# EAGLE schematic out_matrix (EAGLE 9.6.2)
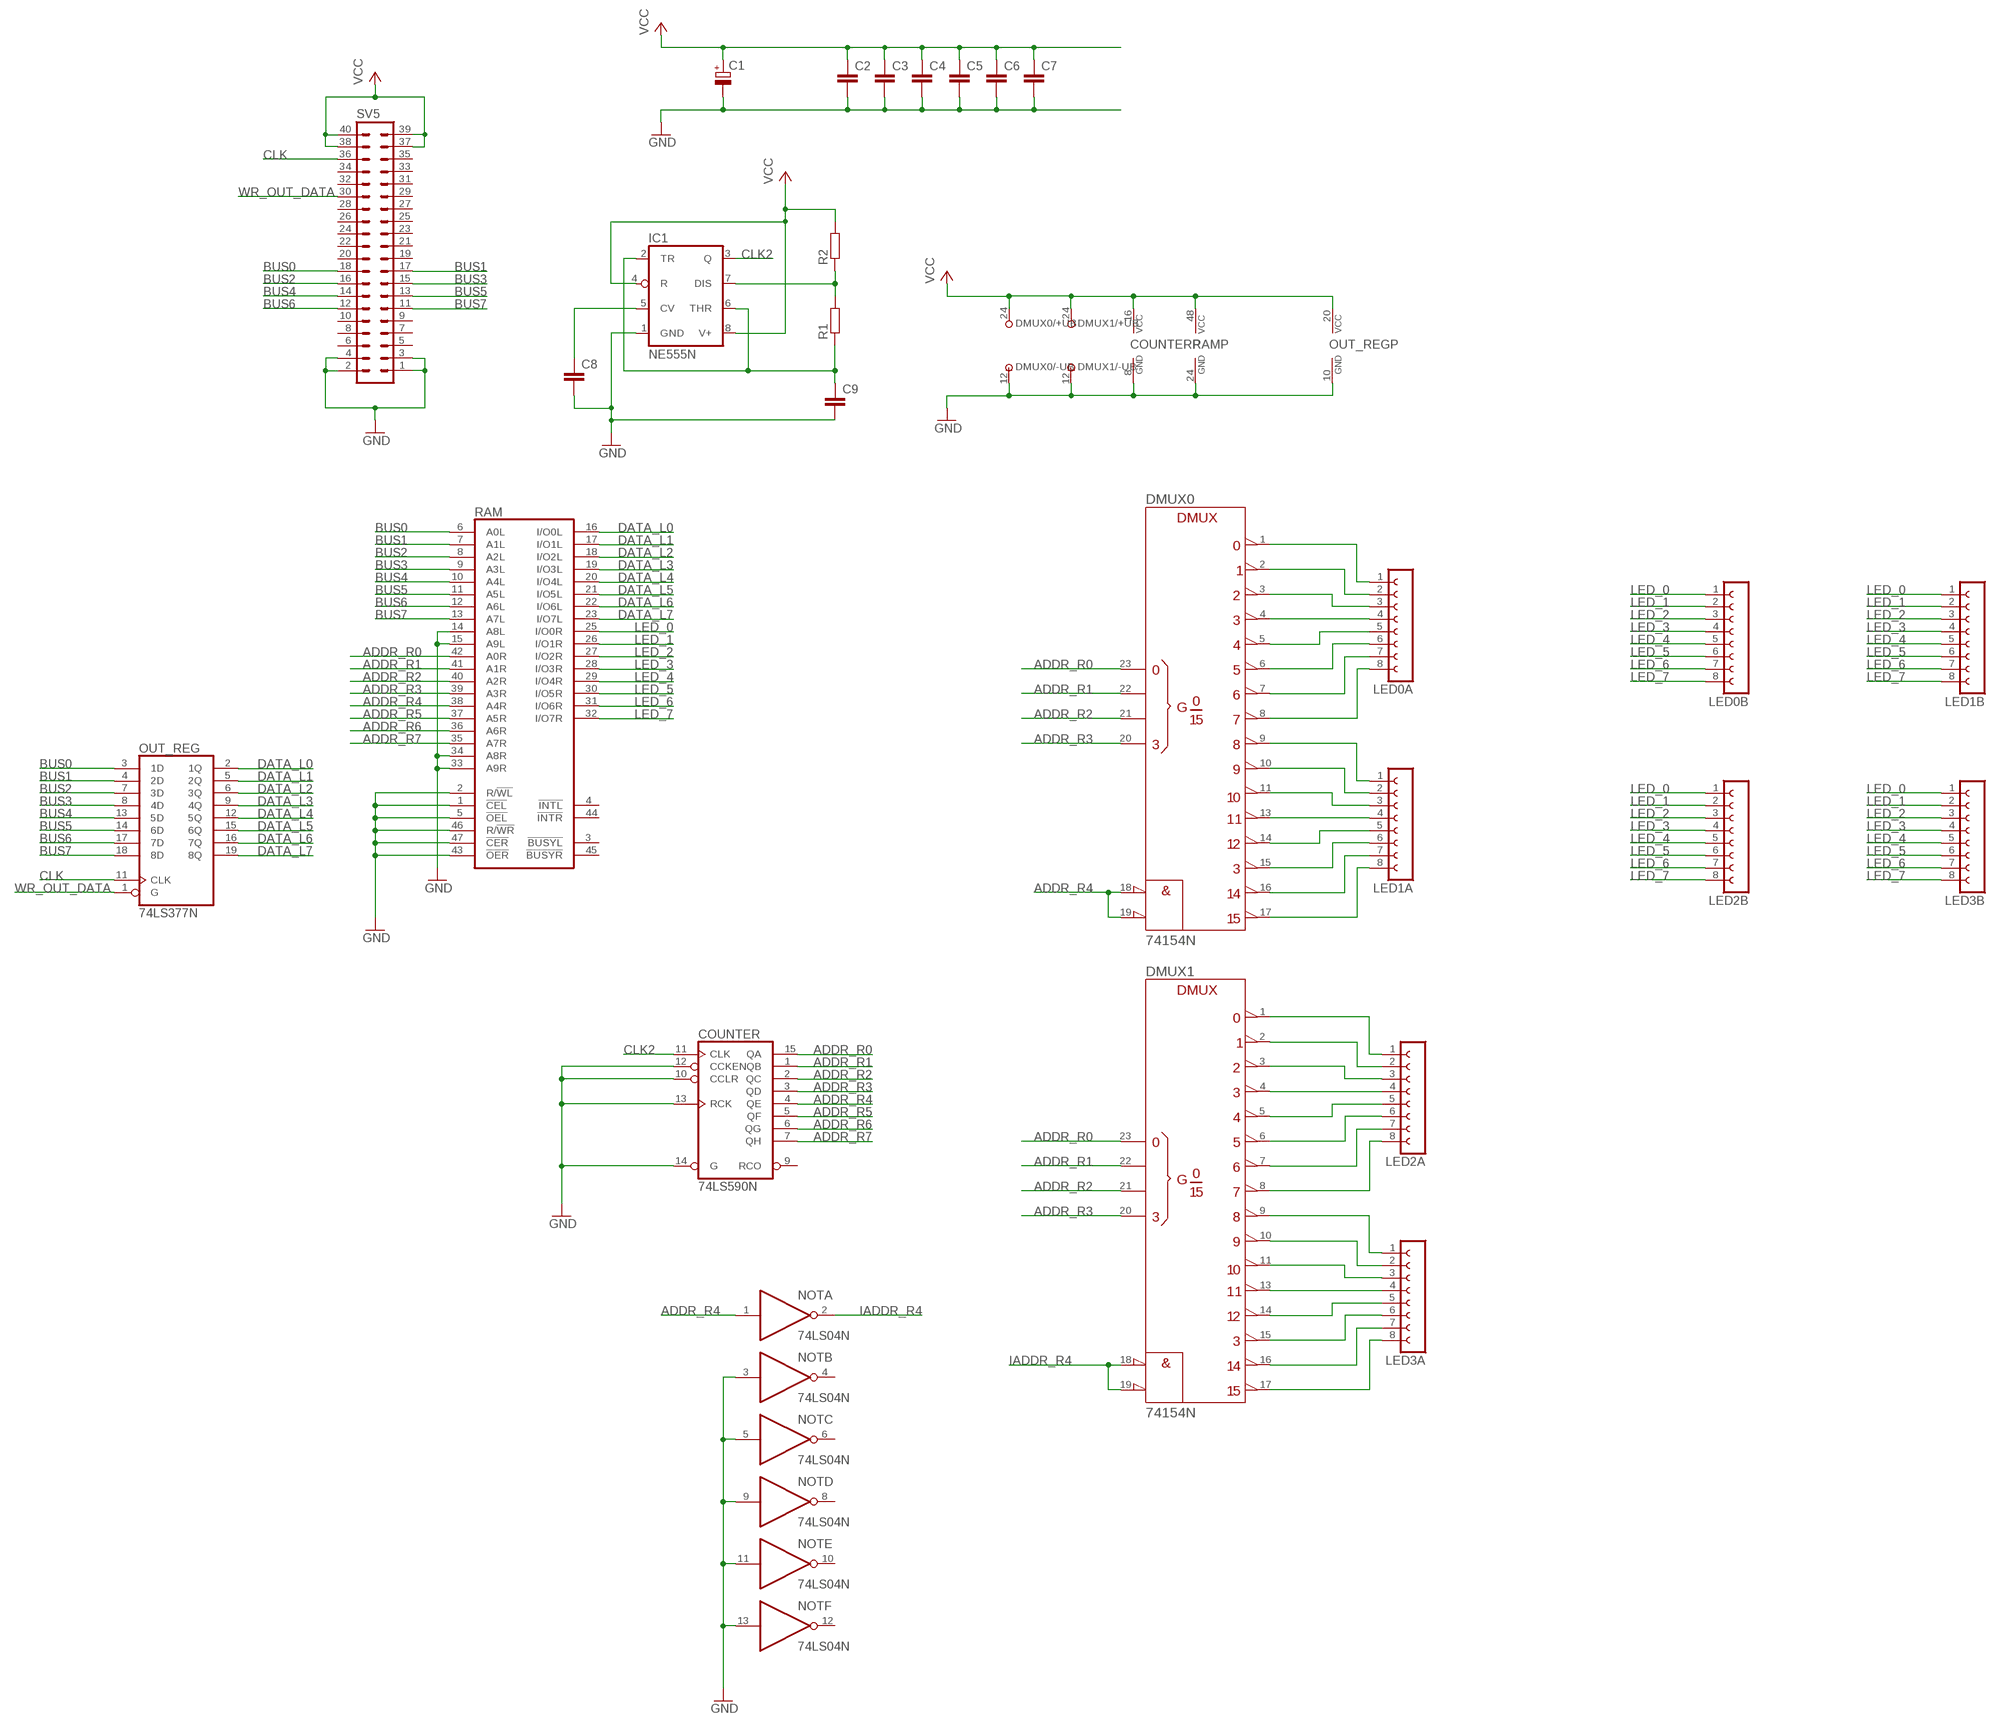
[diagram p0: schematic, sheet 1]

## Parts
C1  CPOL-EUE3.5-8  [E3,5-8]
C2  C-EUC1206K  [C1206K]
C3  C-EUC1206K  [C1206K]
C4  C-EUC1206K  [C1206K]
C5  C-EUC1206K  [C1206K]
C6  C-EUC1206K  [C1206K]
C7  C-EUC1206K  [C1206K]
C8  C-EUC1206K  [C1206K]
C9  C-EUC1206K  [C1206K]
COUNTER  74LS590N  [DIL16]
DMUX0  74154N  [DIL24-3]
DMUX1  74154N  [DIL24-3]
IC1  NE555N  [DIL08]
LED0A  FE08-1  [FE08]
LED0B  FE08-1  [FE08]
LED1A  FE08-1  [FE08]
LED1B  FE08-1  [FE08]
LED2A  FE08-1  [FE08]
LED2B  FE08-1  [FE08]
LED3A  FE08-1  [FE08]
LED3B  FE08-1  [FE08]
NOT  74LS04N  [DIL14]
OUT_REG  74LS377N  [DIL20]
R1  R-EU_M1206  [M1206]
R2  R-EU_M1206  [M1206]
RAM  7130P  [DIL48]
SV5  MA20-2W  [MA20-2W]

## Nets
ADDR_R0: COUNTER.15(QA) DMUX0.23(A) DMUX1.23(A) RAM.42(A0R)
ADDR_R1: COUNTER.1(QB) DMUX0.22(B) DMUX1.22(B) RAM.41(A1R)
ADDR_R2: COUNTER.2(QC) DMUX0.21(C) DMUX1.21(C) RAM.40(A2R)
ADDR_R3: COUNTER.3(QD) DMUX0.20(D) DMUX1.20(D) RAM.39(A3R)
ADDR_R4: COUNTER.4(QE) DMUX0.18(!G1) DMUX0.19(!G2) NOT.1(A:I) RAM.38(A4R)
ADDR_R5: COUNTER.5(QF) RAM.37(A5R)
ADDR_R6: COUNTER.6(QG) RAM.36(A6R)
ADDR_R7: COUNTER.7(QH) RAM.35(A7R)
BUS0: OUT_REG.3(1D) RAM.6(A0L) SV5.18
BUS1: OUT_REG.4(2D) RAM.7(A1L) SV5.17
BUS2: OUT_REG.7(3D) RAM.8(A2L) SV5.16
BUS3: OUT_REG.8(4D) RAM.9(A3L) SV5.15
BUS4: OUT_REG.13(5D) RAM.10(A4L) SV5.14
BUS5: OUT_REG.14(6D) RAM.11(A5L) SV5.13
BUS6: OUT_REG.17(7D) RAM.12(A6L) SV5.12
BUS7: OUT_REG.18(8D) RAM.13(A7L) SV5.11
CLK: OUT_REG.11(CLK) SV5.36
CLK2: COUNTER.11(CLK) IC1.3(Q)
DATA_L0: OUT_REG.2(1Q) RAM.16(I/O0L)
DATA_L1: OUT_REG.5(2Q) RAM.17(I/O1L)
DATA_L2: OUT_REG.6(3Q) RAM.18(I/O2L)
DATA_L3: OUT_REG.9(4Q) RAM.19(I/O3L)
DATA_L4: OUT_REG.12(5Q) RAM.20(I/O4L)
DATA_L5: OUT_REG.15(6Q) RAM.21(I/O5L)
DATA_L6: OUT_REG.16(7Q) RAM.22(I/O6L)
DATA_L7: OUT_REG.19(8Q) RAM.23(I/O7L)
GND: C1.- C2.2 C3.2 C4.2 C5.2 C6.2 C7.2 C8.2 C9.2 COUNTER.8(GND) COUNTER.10(CCLR) COUNTER.12(CCKEN) COUNTER.13(RCK) COUNTER.14(G) DMUX0.12(-UB) DMUX1.12(-UB) IC1.1(GND) NOT.3(B:I) NOT.5(C:I) NOT.9(D:I) NOT.11(E:I) NOT.13(F:I) OUT_REG.10(GND) RAM.1(!CEL) RAM.2(R/!WL) RAM.5(!OEL) RAM.14(A8L) RAM.15(A9L) RAM.24(GND) RAM.33(A9R) RAM.34(A8R) RAM.43(!OER) RAM.46(R/!WR) RAM.47(!CER) SV5.1 SV5.2 SV5.3 SV5.4
IADDR_R4: DMUX1.18(!G1) DMUX1.19(!G2) NOT.2(A:O)
LED_0: LED0B.1 LED1B.1 LED2B.1 LED3B.1 RAM.25(I/O0R)
LED_1: LED0B.2 LED1B.2 LED2B.2 LED3B.2 RAM.26(I/O1R)
LED_2: LED0B.3 LED1B.3 LED2B.3 LED3B.3 RAM.27(I/O2R)
LED_3: LED0B.4 LED1B.4 LED2B.4 LED3B.4 RAM.28(I/O3R)
LED_4: LED0B.5 LED1B.5 LED2B.5 LED3B.5 RAM.29(I/O4R)
LED_5: LED0B.6 LED1B.6 LED2B.6 LED3B.6 RAM.30(I/O5R)
LED_6: LED0B.7 LED1B.7 LED2B.7 LED3B.7 RAM.31(I/O6R)
LED_7: LED0B.8 LED1B.8 LED2B.8 LED3B.8 RAM.32(I/O7R)
N$1: DMUX1.4 LED2A.4
N$2: DMUX1.1 LED2A.1
N$3: DMUX1.2 LED2A.2
N$4: DMUX1.3 LED2A.3
N$5: DMUX0.1 LED0A.1
N$6: DMUX0.2 LED0A.2
N$7: DMUX0.3 LED0A.3
N$8: DMUX0.4 LED0A.4
N$9: DMUX0.8 LED0A.8
N$10: DMUX0.7 LED0A.7
N$11: DMUX0.6 LED0A.6
N$12: DMUX0.5 LED0A.5
N$13: DMUX0.9 LED1A.1
N$14: DMUX0.10 LED1A.2
N$15: DMUX0.11 LED1A.3
N$16: DMUX0.13 LED1A.4
N$17: DMUX0.17 LED1A.8
N$18: DMUX0.16 LED1A.7
N$19: DMUX0.15 LED1A.6
N$20: DMUX0.14 LED1A.5
N$21: DMUX1.8 LED2A.8
N$22: DMUX1.7 LED2A.7
N$23: DMUX1.6 LED2A.6
N$24: DMUX1.5 LED2A.5
N$25: DMUX1.13 LED3A.4
N$26: DMUX1.9 LED3A.1
N$27: DMUX1.10 LED3A.2
N$28: DMUX1.11 LED3A.3
N$29: DMUX1.17 LED3A.8
N$30: DMUX1.16 LED3A.7
N$31: DMUX1.15 LED3A.6
N$32: DMUX1.14 LED3A.5
N$33: IC1.7(DIS) R1.2 R2.1
N$34: C8.1 IC1.5(CV)
N$36: C9.1 IC1.2(TR) IC1.6(THR) R1.1
VCC: C1.+ C2.1 C3.1 C4.1 C5.1 C6.1 C7.1 COUNTER.16(VCC) DMUX0.24(+UB) DMUX1.24(+UB) IC1.4(R) IC1.8(V+) OUT_REG.20(VCC) R2.2 RAM.48(VCC) SV5.37 SV5.38 SV5.39 SV5.40
WR_OUT_DATA: OUT_REG.1(G) SV5.30
Unconnected: COUNTER.9(RCO) NOT.4(B:O) NOT.6(C:O) NOT.8(D:O) NOT.10(E:O) NOT.12(F:O) RAM.3(!BUSYL) RAM.4(!INTL) RAM.44(!INTR) RAM.45(!BUSYR) SV5.5 SV5.6 SV5.7 SV5.8 SV5.9 SV5.10 SV5.19 SV5.20 SV5.21 SV5.22 SV5.23 SV5.24 SV5.25 SV5.26 SV5.27 SV5.28 SV5.29 SV5.31 SV5.32 SV5.33 SV5.34 SV5.35

## Power pins joined to a net without a drawn wire
GND: NOT.7(P:GND)
VCC: NOT.14(P:VCC)

## Library data of the parts
C1 = rcl:CPOL-EU: POLARIZED CAPACITOR, European symbol; SPICEPREFIX: C
C2-C9 = rcl:C-EU: CAPACITOR, European symbol; SPICEPREFIX: C
COUNTER = 74xx-eu:74*590: 8-bit binary COUNTER, output register
DMUX0 DMUX1 = 74ttl-din:74*154: 4-line to 16-line data SELECTOR/MULTIPLEXER
IC1 = linear:*555: TIMER
LED0A LED0B LED1A LED1B LED2A LED2B LED3A LED3B = con-lsta:FE08-1: FEMALE HEADER; OC_FARNELL: unknown; OC_NEWARK: unknown
NOT = 74xx-eu:74*04: Hex INVERTER
OUT_REG = 74xx-eu:74*377: Octal D type FLIP FLOP, enable
R1 R2 = rcl:R-EU_: RESISTOR, European symbol; SPICEPREFIX: R
RAM = memory-idt:7130P: MEMORY; OC_FARNELL: unknown; OC_NEWARK: unknown
SV5 = con-lstb:MA20-2W: PIN HEADER; OC_FARNELL: unknown; OC_NEWARK: unknown